# Altium schematic sheet CELLULAR - nRF9160.SchDoc: CELLULAR - nRF9160
size A3; Organization: Tekt Industries; DocumentNumber: 1; Revision: A.01; SheetNumber: 1; SheetTotal: 3; ApprovedBy: M J Adams; CheckedBy: M J Adams; Author: M J Adams; CompanyName: Tekt Industries; DrawnBy: M J Adams; Engineer: M J Adams; DocumentSize: A3; ProjectTitle: CODE OF CONSCIENCE
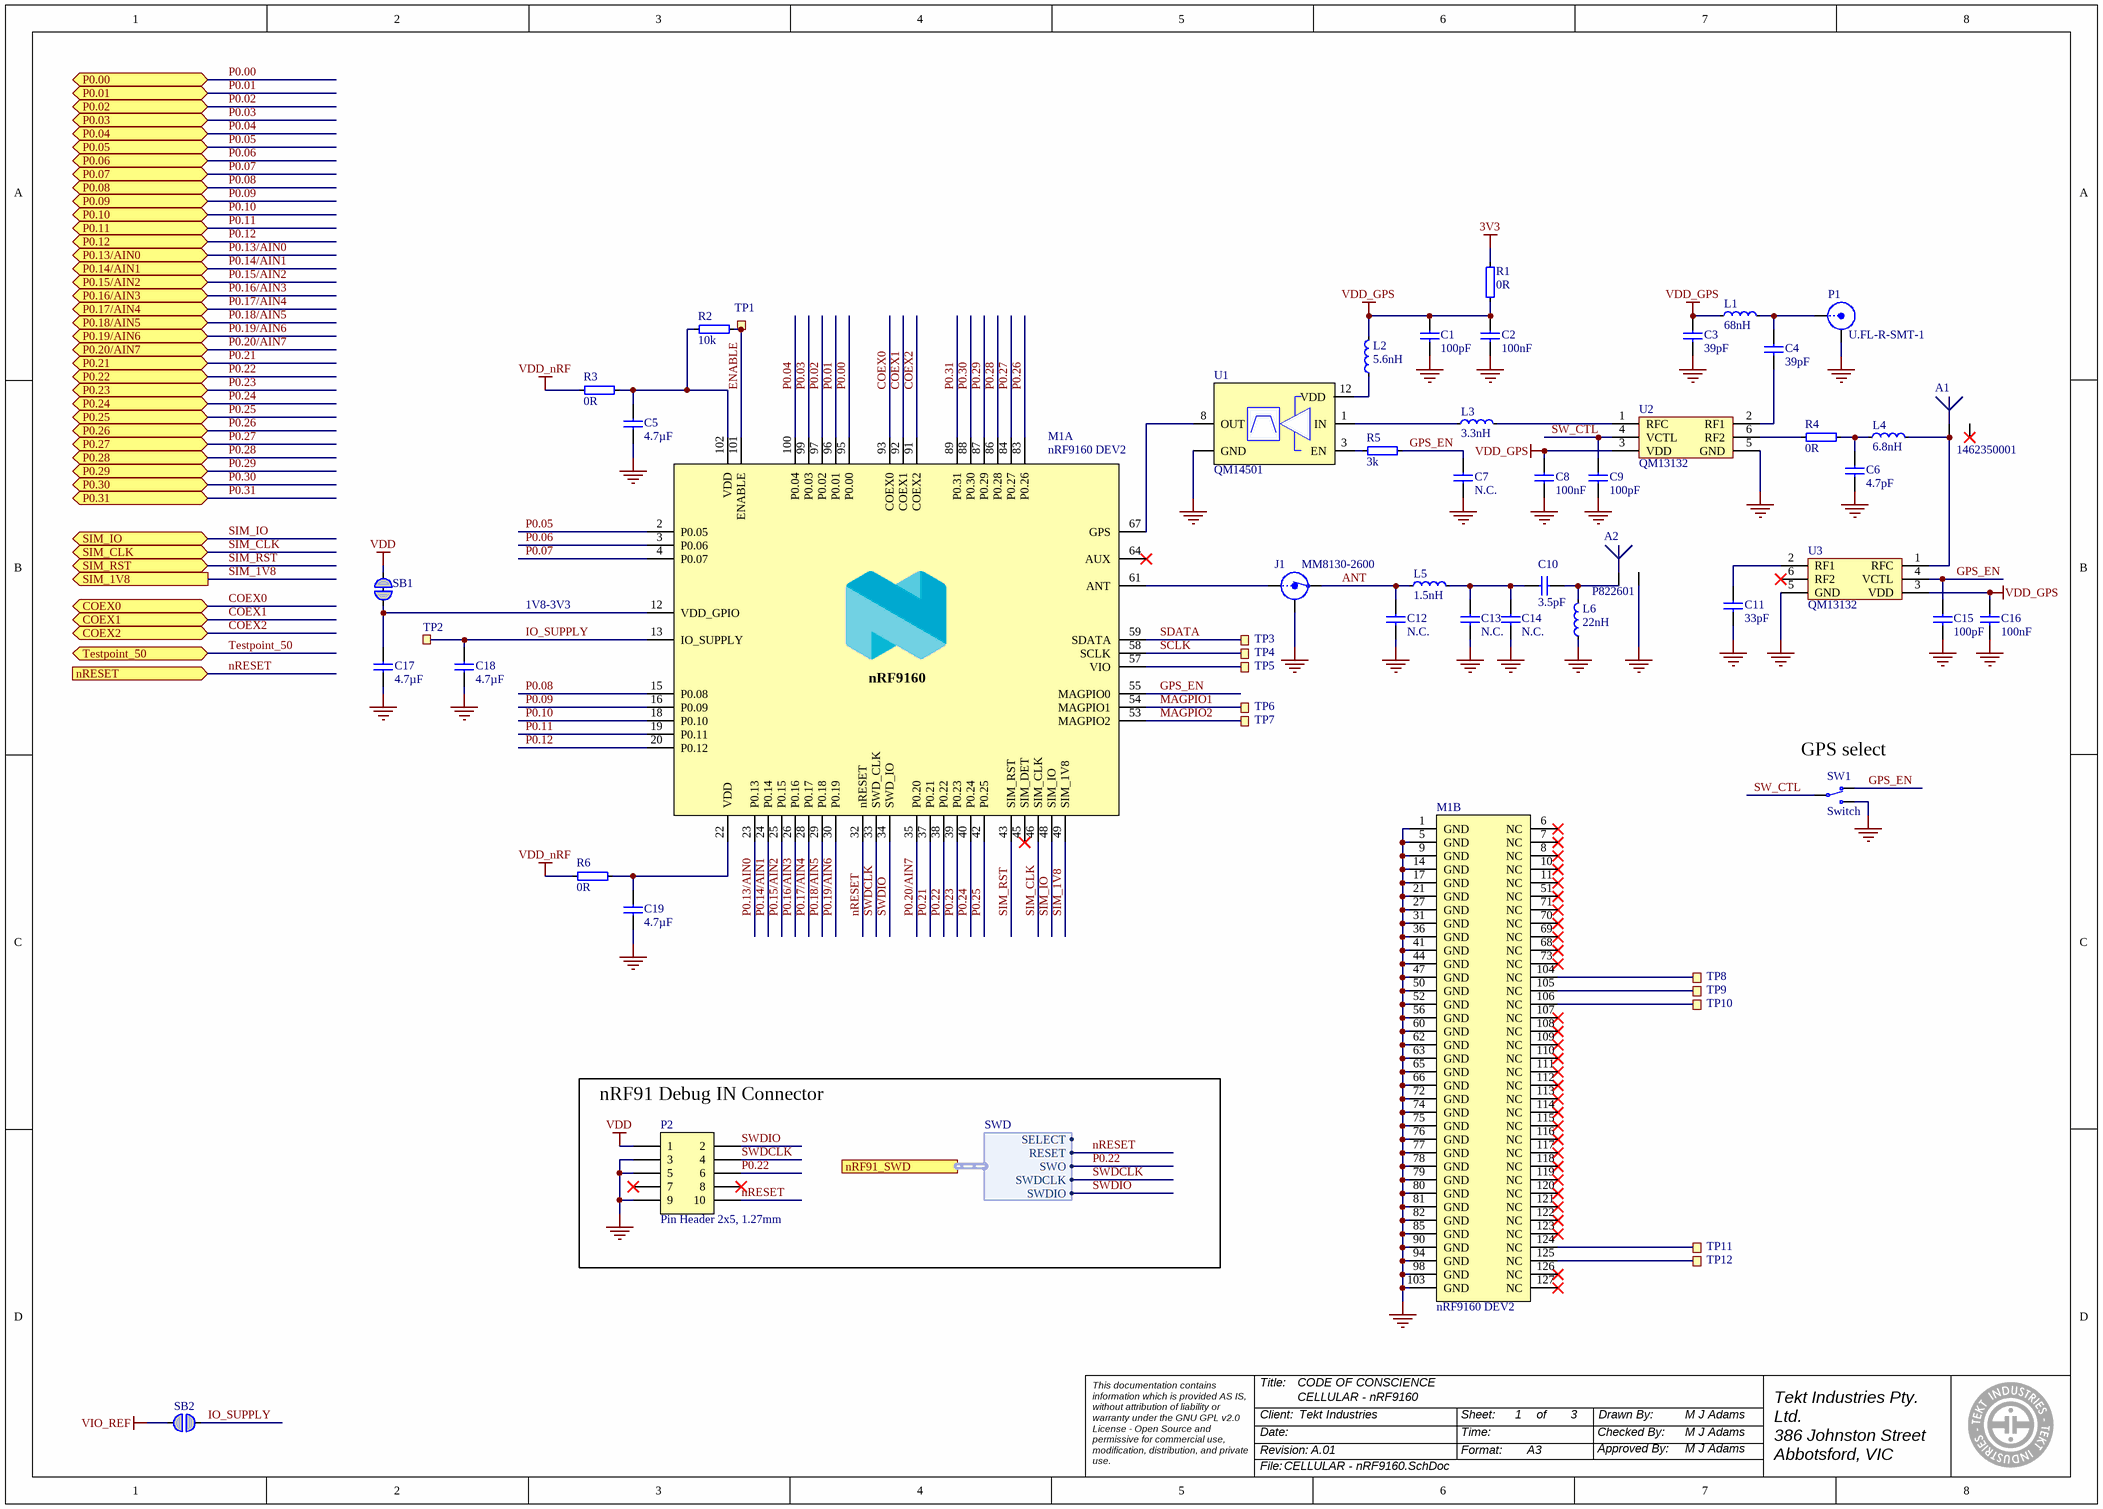
[diagram p0: CELLULAR - nRF9160.SchDoc]

## Parts
A1  1462350001  [1462350001]
A2  P822601  [P822601]
C1  100pF  [CAPC0603X03L_C]
C2  100nF  [CAPC0603X03L_C]
C3  39pF  [CAPC0603X03L_C]
C4  39pF  [CAPC0603X03L_C]
C5  4.7µF  [CAPC1005X04L]
C6  4.7pF  [CAPC0603X03L_C]
C7  N.C.  [CAPC0603X03L_C]
C8  100nF  [CAPC0603X03L_C]
C9  100pF  [CAPC0603X03L_C]
C10  3.5pF  [CAPC0603X03L_C]
C11  33pF  [CAPC0603X03L_C]
C12  N.C.  [CAPC0603X03L_C]
C13  N.C.  [CAPC0603X03L_C]
C14  N.C.  [CAPC0603X03L_C]
C15  100pF  [CAPC0603X03L_C]
C16  100nF  [CAPC0603X03L_C]
C17  4.7µF  [CAPC1005X04L]
C18  4.7µF  [CAPC1005X04L]
C19  4.7µF  [CAPC1005X04L]
J1  MM8130-2600  [COAXIAL-SWF]
L1  68nH  [INDC1005X04L]
L2  5.6nH  [INDC0603X03L_C]
L3  3.3nH  [INDC0603X03L_C]
L4  6.8nH  [INDC0603X03L_C]
L5  1.5nH  [INDC0603X03L_C]
L6  22nH  [INDC0603X03L_C]
M1  nRF9160 DEV2  [nRF9160_DEV2_MODULE]  (parts A,B of 2)
P1  U.FL-R-SMT-1  [COAXIAL RF U.FL-R-SMT-1]
P2  Pin Header 2x5, 1.27mm  [HDR_2x5-SMD-1.27mm-K]
R1  0R  [RESC1005X04L]
R2  10k  [RESC0603X03L_C]
R3  0R  [RESC0603X03L_C]
R4  0R  [RESC0603X03L_C]
R5  3k  [RESC0603X03L_C]
R6  0R  [RESC0603X03L_C]
SB1  Solderbridge  [Solderbridge_Shorted]  (value not drawn)  (net tie, no BOM)
SB2  Solderbridge  [Solderbridge]  (value not drawn)  (no BOM)
SW1  Switch  [CJS-120xA]
TP1  Ø1.5mm,SMD  [TP_SMD_Ø1.5mm]  (value not drawn)  (no BOM)
TP2  Ø1.0mm,SMD  [TP_SMD_Ø1.0mm]  (value not drawn)  (no BOM)
TP3  Ø1.0mm,SMD  [TP_SMD_Ø1.0mm]  (value not drawn)  (no BOM)
TP4  Ø1.0mm,SMD  [TP_SMD_Ø1.0mm]  (value not drawn)  (no BOM)
TP5  Ø1.0mm,SMD  [TP_SMD_Ø1.0mm]  (value not drawn)  (no BOM)
TP6  Ø1.0mm,SMD  [TP_SMD_Ø1.0mm]  (value not drawn)  (no BOM)
TP7  Ø1.0mm,SMD  [TP_SMD_Ø1.0mm]  (value not drawn)  (no BOM)
TP8  Ø1.0mm,SMD  [TP_SMD_Ø1.0mm]  (value not drawn)  (no BOM)
TP9  Ø1.0mm,SMD  [TP_SMD_Ø1.0mm]  (value not drawn)  (no BOM)
TP10  Ø1.0mm,SMD  [TP_SMD_Ø1.0mm]  (value not drawn)  (no BOM)
TP11  Ø1.0mm,SMD  [TP_SMD_Ø1.0mm]  (value not drawn)  (no BOM)
TP12  Ø1.0mm,SMD  [TP_SMD_Ø1.0mm]  (value not drawn)  (no BOM)
U1  QM14501  [QM14501]
U2  QM13132  [QM13132]
U3  QM13132  [QM13132]

## Blocks framed on the sheet
nRF91 Debug IN Connector: P2

## Ports
COEX0 (bidir), COEX1 (bidir), COEX2 (bidir), nRESET (in), nRF91_SWD (harness SWD), P0.00 (bidir), P0.01 (bidir), P0.02 (bidir), P0.03 (bidir), P0.04 (bidir), P0.05 (bidir), P0.06 (bidir), P0.07 (bidir), P0.08 (bidir), P0.09 (bidir), P0.10 (bidir), P0.11 (bidir), P0.12 (bidir), P0.13/AIN0 (bidir), P0.14/AIN1 (bidir), P0.15/AIN2 (bidir), P0.16/AIN3 (bidir), P0.17/AIN4 (bidir), P0.18/AIN5 (bidir), P0.19/AIN6 (bidir), P0.20/AIN7 (bidir), P0.21 (bidir), P0.22 (bidir), P0.23 (bidir), P0.24 (bidir), P0.25 (bidir), P0.26 (bidir), P0.27 (bidir), P0.28 (bidir), P0.29 (bidir), P0.30 (bidir), P0.31 (bidir), SIM_1V8 (out), SIM_CLK (bidir), SIM_IO (bidir), SIM_RST (bidir), Testpoint_50 (bidir)

## Harnesses
SWD: SWDIO, SWDCLK, SWO, RESET, SELECT

## Nets
3V3: R1.1
GND: A2.2 C1.1 C2.1 C3.2 C5.2 C6.2 C7.1 C8.2 C9.2 C11.2 C12.1 C13.1 C14.1 C15.2 C16.2 C17.2 C18.2 C19.1 J1.2(Shield) L6.1 M1.1(GND) M1.5(GND) M1.9(GND) M1.14(GND) M1.17(GND) M1.21(GND) M1.27(GND) M1.31(GND) M1.36(GND) M1.41(GND) M1.44(GND) M1.47(GND) M1.50(GND) M1.52(GND) M1.56(GND) M1.60(GND) M1.62(GND) M1.63(GND) M1.65(GND) M1.66(GND) M1.72(GND) M1.74(GND) M1.75(GND) M1.76(GND) M1.77(GND) M1.78(GND) M1.79(GND) M1.80(GND) M1.81(GND) M1.82(GND) M1.85(GND) M1.90(GND) M1.94(GND) M1.98(GND) M1.103(GND) P1.2(Y) P2.3 P2.5 P2.9 SW1.3(N.O) U1.2(GND) U1.4(GND) U1.5(GND) U1.6(GND) U1.7(GND) U1.9(GND) U1.10(GND) U1.11(GND) U2.5(GND) U3.5(GND)
VDD: P2.1 SB1.1
VDD_GPS: C1.2 C2.2 C3.1 C8.1 C16.1 L1.1 L2.2 R1.2 U2.3(VDD) U3.3(VDD)
VDD_nRF: R3.1 R6.1
VIO_REF: SB2.2
ANT: C12.2 J1.3(OUT) L5.1
COEX0: M1.93(COEX0) ; port COEX0
COEX1: M1.92(COEX1) ; port COEX1
COEX2: M1.91(COEX2) ; port COEX2
ENABLE: M1.101(ENABLE) R2.2 TP1.1
GPS_EN: C7.2 C15.1 M1.55(MAGPIO0) R5.2 SW1.1(N.C) U3.4(VCTL)
IO_SUPPLY: C18.1 M1.13(IO_SUPPLY) SB2.1 TP2.1
MAGPIO1: M1.54(MAGPIO1) TP6.1
MAGPIO2: M1.53(MAGPIO2) TP7.1
nRESET: M1.32(nRESET) P2.10 ; port nRESET, port nRF91_SWD.RESET
P0.00: M1.95(P0.00) ; port P0.00
P0.01: M1.96(P0.01) ; port P0.01
P0.02: M1.97(P0.02) ; port P0.02
P0.03: M1.99(P0.03) ; port P0.03
P0.04: M1.100(P0.04) ; port P0.04
P0.05: M1.2(P0.05) ; port P0.05
P0.06: M1.3(P0.06) ; port P0.06
P0.07: M1.4(P0.07) ; port P0.07
P0.08: M1.15(P0.08) ; port P0.08
P0.09: M1.16(P0.09) ; port P0.09
P0.10: M1.18(P0.10) ; port P0.10
P0.11: M1.19(P0.11) ; port P0.11
P0.12: M1.20(P0.12) ; port P0.12
P0.13/AIN0: M1.23(P0.13) ; port P0.13/AIN0
P0.14/AIN1: M1.24(P0.14) ; port P0.14/AIN1
P0.15/AIN2: M1.25(P0.15) ; port P0.15/AIN2
P0.16/AIN3: M1.26(P0.16) ; port P0.16/AIN3
P0.17/AIN4: M1.28(P0.17) ; port P0.17/AIN4
P0.18/AIN5: M1.29(P0.18) ; port P0.18/AIN5
P0.19/AIN6: M1.30(P0.19) ; port P0.19/AIN6
P0.20/AIN7: M1.35(P0.20) ; port P0.20/AIN7
P0.21: M1.37(P0.21) ; port P0.21
P0.22: M1.38(P0.22) P2.6 ; port P0.22, port nRF91_SWD.SWO
P0.23: M1.39(P0.23) ; port P0.23
P0.24: M1.40(P0.24) ; port P0.24
P0.25: M1.42(P0.25) ; port P0.25
P0.26: M1.83(P0.26) ; port P0.26
P0.27: M1.84(P0.27) ; port P0.27
P0.28: M1.86(P0.28) ; port P0.28
P0.29: M1.87(P0.29) ; port P0.29
P0.30: M1.88(P0.30) ; port P0.30
P0.31: M1.89(P0.31) ; port P0.31
SCLK: M1.58(SCLK) TP4.1
SDATA: M1.59(SDATA) TP3.1
SIM_1V8: M1.49(SIM_1V8) ; port SIM_1V8
SIM_CLK: M1.46(SIM_CLK) ; port SIM_CLK
SIM_IO: M1.48(SIM_IO) ; port SIM_IO
SIM_RST: M1.43(SIM_RST) ; port SIM_RST
SW_CTL: C9.1 SW1.2(COM) U2.4(VCTL)
SWDCLK: M1.33(SWD_CLK) P2.4 ; port nRF91_SWD.SWDCLK
SWDIO: M1.34(SWD_IO) P2.2 ; port nRF91_SWD.SWDIO
Testpoint_50: port Testpoint_50
NetA1_1: A1.1 L4.2 U3.1(RFC)
NetA2_1: A2.1 C10.2 L6.2
NetC4_1: C4.1 U2.2(RF1)
NetC4_2: C4.2 L1.2 P1.1(X)
NetC5_1: C5.1 M1.102(VDD) R2.1 R3.2
NetC6_1: C6.1 L4.1 R4.2
NetC10_1: C10.1 C13.2 C14.2 L5.2
NetC11_1: C11.1 U3.2(RF1)
NetC17_1: C17.1 M1.12(VDD_GPIO) SB1.2
NetC19_2: C19.2 M1.22(VDD) R6.2
NetJ1_1: J1.1(IN) M1.61(ANT)
NetL2_1: L2.1 U1.12(VDD)
NetL3_1: L3.1 U1.1(IN)
NetL3_2: L3.2 U2.1(RFC)
NetM1_57: M1.57(VIO) TP5.1
NetM1_67: M1.67(GPS) U1.8(OUT)
NetM1_104: M1.104(NC) TP8.1
NetM1_105: M1.105(NC) TP9.1
NetM1_106: M1.106(NC) TP10.1
NetM1_124: M1.124(NC) TP11.1
NetM1_125: M1.125(NC) TP12.1
NetR4_1: R4.1 U2.6(RF2)
NetR5_1: R5.1 U1.3(EN)

Not connected (* = marked no-connect by the designer): A1 2*; M1 6(NC)* 7(NC)* 8(NC)* 10(NC)* 11(NC)* 45(SIM_DET)* 51(NC)* 64(AUX)* 68(NC)* 69(NC)* 70(NC)* 71(NC)* 73(NC)* 107(NC)* 108(NC)* 109(NC)* 110(NC)* 111(NC)* 112(NC)* 113(NC)* 114(NC)* 115(NC)* 116(NC)* 117(NC)* 118(NC)* 119(NC)* 120(NC)* 121(NC)* 122(NC)* 123(NC)* 126(NC)* 127(NC)*; P2 7* 8*; U3 6(RF2)*

## Notes on the sheet
- 1V8-3V3
- (near SW1) GPS select
- Title:
- Date:
- Revision:
- Client:
- Sheet:
- Time:
- Format:
- A3
- of
- Checked By:
- Approved By:
- Drawn By:
- Tekt Industries Pty. Ltd.
  386 Johnston Street
  Abbotsford, VIC
  Australia, 3067
- This documentation contains information which is provided AS IS, without attribution of liability or warranty under the GNU GPL v2.0 License - Open Source and permissive for commercial use, modification, distribution, and private use.
- File:
- (in symbol nRF9160_DEV2_MODULE_DK, part A) nRF9160

## Library data of the parts
A1 = 1462350001_GPS: ANTENNA MOLDED 1.575GHZ GPS; Manufacturer: Molex; Assembly: Mounted; Artikkelnr Noca: N.A.; Part Number: 1462350001_GPS; Manufacturer Part No.: 1462350001; ComponentLink1URL: *; ComponentLink1Description: Datasheet; ComponentLink2URL: *; ComponentLink2Description: Supplier link; HelpURL: https://www.molex.com/pdm_docs/sd/1462350001_sd.pdf; Footprint Doc: 1462350001; LatestRevisionDate: 2018-04-30; Pin Count: 3; Publisher: Nordic Semiconductor; Published: 2018-04-30; Value: 1462350001; Note: *; Supplier: Digi-Key; Supplier Part No.: WM15009CT-ND; Supplier 2: 538-146235-0001; Supplier Part Number 2: *; Part number IPS: N.A.
A2 = P822601: ANTENNA PRESTTA OCTABAND LTE; Manufacturer: Ethertronics; Artikkelnr Noca: N.A.; Part Number: P822601; Manufacturer Part No.: P822601; Footprint Doc: P822601; LatestRevisionDate: 2017-07-28; Pin Count: 2; Publisher: Nordic Semiconductor; Published: 2017-07-28; Value: P822601; Note: *; ComponentLink1URL: *; ComponentLink1Description: Datasheet; ComponentLink2URL: *; ComponentLink2Description: Supplier link; HelpURL: http://www.ethertronics.com/wp-content/uploads/2016/11/Prestta-P822601-P822602-Standard-Cellular-Octa-Band-20160904.pdf; Supplier: Digi-Key; Supplier Part No.: 939-1057-1-ND; Supplier 2: Digikey; Supplier Part Number 2: 939-1057-1-ND; Part number IPS: N.A.
C1 C9 C15 = C0201-100p: Capacitor, NP0, ±2%; Manufacturer: Murata Electronics North America; Manufacturer Part No.: GRM0335C1E101JA01D; Part number IPS: 00000007853; Note: 25V; Artikkelnr Noca: N.A.; Part Number: C0201-100p; ComponentLink1URL: *; ComponentLink1Description: Datasheet; ComponentLink2URL: *; ComponentLink2Description: Supplier link; HelpURL: *; Footprint Doc: 0201; LatestRevisionDate: 2017-11-09; Pin Count: 2; Publisher: Nordic Semiconductor; Published: 2014-11-13; Value: 100pF; Supplier: Digi-Key; Supplier Part No.: 490-3160-1-ND; Supplier 2: *; Supplier Part Number 2: *
C2 C8 C16 = C0201-100n: Capacitor, X5R, ±10%; Manufacturer: Murata Electronics North America; Manufacturer Part No.: GRM033R61C104KE84D; Part number IPS: 00000001248; Note: 16V; Artikkelnr Noca: N.A.; Part Number: C0201-100n; ComponentLink1URL: *; ComponentLink1Description: Datasheet; ComponentLink2URL: *; ComponentLink2Description: Supplier link; HelpURL: *; Footprint Doc: 0201; LatestRevisionDate: 2017-11-09; Pin Count: 2; Publisher: Nordic Semiconductor; Published: 2014-11-13; Value: 100nF; Supplier: Digi-Key; Supplier Part No.: 490-9985-1-ND; Supplier 2: *; Supplier Part Number 2: *
C3 C4 = C0201-39p: Chip Cap 0201; Manufacturer: Murata Electronics North America; Manufacturer Part No.: GRM0335C1H390JA01D; Note: Chip Cap 1%; Artikkelnr Noca: N.A.; Part Number: C0201-39p; ComponentLink1URL: *; ComponentLink1Description: Datasheet; ComponentLink2URL: *; ComponentLink2Description: Supplier link; HelpURL: *; Footprint Doc: 0201; LatestRevisionDate: 2014-11-13; Pin Count: 2; Publisher: Nordic Semiconductor; Published: 2014-11-13; Value: 39pF; Supplier: Digi-Key; Supplier Part No.: 490-11326-1-ND; Supplier 2: *; Supplier Part Number 2: *; Part number IPS: N.A.
C5 C17-C19 = C0402-4µ7: Capacitor, X5R, ±20%; Manufacturer: Murata Electronics North America; Manufacturer Part No.: ZRB15XR61A475KE01D; Part number IPS: 00000001251; Note: 10V; Artikkelnr Noca: 20039482; Part Number: C0402-4µ7; ComponentLink1URL: *; ComponentLink1Description: Datasheet; ComponentLink2URL: *; ComponentLink2Description: Supplier link; HelpURL: *; Footprint Doc: 0402; LatestRevisionDate: 2017-11-09; Pin Count: 2; Publisher: Nordic Semiconductor; Published: 2009-05-08; Value: 4.7µF; Supplier: Digi-Key; Supplier Part No.: 490-13252-1-ND; Supplier 2: *; Supplier Part Number 2: *
C6 = C0201-4.7p: Chip Cap 0201; Manufacturer: Murata Electronics North America; Manufacturer Part No.: GRM0335C1H4R7CA01D; Note: Chip Cap 1%; Artikkelnr Noca: N.A.; Part Number: C0201-4.7p; ComponentLink1URL: *; ComponentLink1Description: Datasheet; ComponentLink2URL: *; ComponentLink2Description: Supplier link; HelpURL: *; Footprint Doc: 0201; LatestRevisionDate: 2014-11-13; Pin Count: 2; Publisher: Nordic Semiconductor; Published: 2014-11-13; Value: 4.7pF; Supplier: Digi-Key; Supplier Part No.: 490-6130-1-ND; Supplier 2: *; Supplier Part Number 2: *; Part number IPS: N.A.
C7 C12-C14 = C0201-N.C.: Not mounted; Note: Chip Cap; Artikkelnr Noca: N.A.; Assembly: Not mounted; Part Number: C0201-N.C.; ComponentLink1URL: *; ComponentLink1Description: Datasheet; ComponentLink2URL: *; ComponentLink2Description: Supplier link; HelpURL: *; Footprint Doc: 0201; LatestRevisionDate: 2014-11-13; Pin Count: 2; Publisher: Nordic Semiconductor; Published: 2014-11-13; Value: N.C.; Part number IPS: N.A.; Supplier Part No.: *; Supplier 2: *
C10 = C0201-3.3p: Chip Cap 0201; Manufacturer: Taiyo Yuden; Manufacturer Part No.: UMK063CG3R5CTHF; Note: Chip Cap 1%; Artikkelnr Noca: N.A.; Part Number: C0201-3.3p; ComponentLink1URL: *; ComponentLink1Description: Datasheet; ComponentLink2URL: *; ComponentLink2Description: Supplier link; HelpURL: *; Footprint Doc: 0201; LatestRevisionDate: 2014-11-13; Pin Count: 2; Publisher: Nordic Semiconductor; Published: 2014-11-13; Value: 3.5pF; Part number IPS: N.A.; Supplier: Digi-Key; Supplier Part No.: 587-5326-1-ND; Supplier 2: *; Supplier Part Number 2: *
C11 = C0201-33p: Chip Cap 0201; Manufacturer: Murata Electronics North America; Manufacturer Part No.: GRM0335C1H330JA01D; Note: Chip Cap 1%; Artikkelnr Noca: N.A.; Part Number: C0201-33p; ComponentLink1URL: *; ComponentLink1Description: Datasheet; ComponentLink2URL: *; ComponentLink2Description: Supplier link; HelpURL: *; Footprint Doc: 0201; LatestRevisionDate: 2014-11-13; Pin Count: 2; Publisher: Nordic Semiconductor; Published: 2014-11-13; Value: 33pF; Supplier: Digi-Key; Supplier Part No.: 490-6126-1-ND; Supplier 2: *; Supplier Part Number 2: *; Part number IPS: N.A.
J1 = MM8130-2600: Coaxial Connector with Switch; Manufacturer: Murata; Part number IPS: N.A.; Artikkelnr Noca: 55029011; Part Number: MM8130-2600; Manufacturer Part No.: MM8130-2600; LatestRevisionDate: 2014-04-24; Pin Count: 3; Publisher: Nordic Semiconductor; Published: 2014-04-24; Value: MM8130-2600; Note: *; Footprint Doc: COAXIAL-SWF; ComponentLink1URL: *; ComponentLink1Description: Datasheet; ComponentLink2URL: *; ComponentLink2Description: Supplier link; HelpURL: http://www.murata.com/products/catalog/pdf/o33e.pdf; Supplier: Digi-Key; Supplier Part No.: 490-4981-1-ND; Supplier 2: Mouser; Supplier Part Number 2: 81-MM8130-2600RA2
L1 = L0402-68n: Chip Inductor; Manufacturer: Murata Electronics North America; Manufacturer Part No.: LQG15HS68NJ02D; Artikkelnr Noca: N.A.; Part Number: L0402-68n; ComponentLink1URL: *; ComponentLink1Description: Datasheet; ComponentLink2URL: *; ComponentLink2Description: Supplier link; HelpURL: *; Footprint Doc: 0402; LatestRevisionDate: 2014-06-12; Pin Count: 2; Publisher: Nordic Semiconductor; Published: 2014-06-12; Value: 68nH; Note: *; Supplier: Digi-Key; Supplier Part No.: 490-2633-1-ND; Supplier 2: *; Supplier Part Number 2: *; Part number IPS: N.A.
L2 = L0201-5n6: Chip Inductor; Manufacturer: Murata Electronics North America; Manufacturer Part No.: LQP03TN5N6H02D; Note: High frequency chip inductor ±5%; Artikkelnr Noca: N.A.; Part Number: L0201-5n6; ComponentLink1URL: *; ComponentLink1Description: Datasheet; ComponentLink2Description: Supplier link; HelpURL: *; Footprint Doc: 0201; LatestRevisionDate: 2013-04-10; Pin Count: 2; Publisher: Nordic Semiconductor; Published: 2013-04-10; Value: 5.6nH; Part number IPS: N.A.; ComponentLink2URL: *; Supplier: Digi-Key; Supplier Part No.: 490-6734-1-ND; Supplier 2: *; Supplier Part Number 2: *
L3 = L0201-3n3: Chip Inductor; Manufacturer: Murata Electronics North America; Manufacturer Part No.: LQP03TN3N3B02D; Note: High frequency chip inductor ±5%; Artikkelnr Noca: N.A.; Part Number: L0201-3n3; ComponentLink1URL: *; ComponentLink1Description: Datasheet; ComponentLink2Description: Supplier link; HelpURL: *; Footprint Doc: 0201; LatestRevisionDate: 2013-04-10; Pin Count: 2; Publisher: Nordic Semiconductor; Published: 2013-04-10; Value: 3.3nH; Part number IPS: N.A.; ComponentLink2URL: *; Supplier: Digi-Key; Supplier Part No.: 490-6728-1-ND; Supplier 2: *; Supplier Part Number 2: *
L4 = L0201-6n8: Chip Inductor; Manufacturer: Murata Electronics North America; Manufacturer Part No.: LQP03TN6N8J02D; Note: High frequency chip inductor ±5%; Artikkelnr Noca: N.A.; Part Number: L0201-6n8; ComponentLink1URL: *; ComponentLink1Description: Datasheet; ComponentLink2URL: *; ComponentLink2Description: Supplier link; HelpURL: *; Footprint Doc: 0201; LatestRevisionDate: 2013-04-10; Pin Count: 2; Publisher: Nordic Semiconductor; Published: 2013-04-10; Value: 6.8nH; Supplier: Digi-Key; Supplier Part No.: 490-5564-1-ND; Supplier 2: *; Supplier Part Number 2: *; Part number IPS: N.A.
L5 = L0201-1n5: Chip Inductor; Manufacturer: Murata Electronics North America; Manufacturer Part No.: LQP03TG1N5B02D; Note: High frequency chip inductor ±5%; Artikkelnr Noca: N.A.; Part Number: L0201-1n5; ComponentLink1URL: *; ComponentLink1Description: Datasheet; ComponentLink2Description: Supplier link; HelpURL: *; Footprint Doc: 0201; LatestRevisionDate: 2013-04-10; Pin Count: 2; Publisher: Nordic Semiconductor; Published: 2013-04-10; Value: 1.5nH; Part number IPS: N.A.; ComponentLink2URL: *; Supplier: Digi-Key; Supplier Part No.: 490-14701-1-ND; Supplier 2: *; Supplier Part Number 2: *
L6 = L0201-22n: Chip Inductor; Manufacturer: Taiyo Yuden; Manufacturer Part No.: HKQ0603W22NH-T; Note: High frequency chip inductor ±10%; Artikkelnr Noca: N.A.; Part Number: L0201-22n; ComponentLink1URL: *; ComponentLink1Description: Datasheet; ComponentLink2Description: Supplier link; HelpURL: *; Footprint Doc: 0201; LatestRevisionDate: 2013-04-10; Pin Count: 2; Publisher: Nordic Semiconductor; Published: 2013-04-10; Value: 22nH; Part number IPS: N.A.; ComponentLink2URL: *; Supplier: Digi-Key; Supplier Part No.: 587-4663-1-ND; Supplier 2: *; Supplier Part Number 2: *
M1 = nRF9160_DEV2_MODULE_DK: nRF9160 MODULE, SiP LGA; Manufacturer: Nordic Semiconductor ASA; Manufacturer Part No.: NRF9160-SICA; Part number Sanmina: LFNPNSM800002; Delivery: X; Part Number: nRF9160_DEV2_MODULE_DK; Datasheet: *; Footprint Doc: 16.0*10.5*1.1; Pin Count: 161; Value: nRF9160 DEV2; Supplier: Digi-Key; 2nd Manufacturer: *; 2nd Manufacturer Part Number: *; 3rd Manufacturer: *; 3rd Manufacturer Part Number: *; Supplier Part No.: 1490-1074-1-ND
P1 = U.FL-R-SMT-1: ONN U.FL RCPT STR 50 OHM SMD; Manufacturer: Hirose Electric Co Ltd; Artikkelnr Noca: N.A.; Part Number: U.FL-R-SMT-1; Manufacturer Part No.: U.FL-R-SMT-1; ComponentLink1URL: https://media.digikey.com/pdf/Data%20Sheets/Hirose%20PDFs/UFL%20Series.pdf; ComponentLink1Description: Datasheet; ComponentLink2URL: *; ComponentLink2Description: Supplier link; HelpURL: *; Footprint Doc: COAXIAL RF U.FL-R-SMT-1; LatestRevisionDate: 2018-05-07; Pin Count: 3; Publisher: Nordic Semiconductor; Published: 2018-05-07; Value: U.FL-R-SMT-1; Note: *; Supplier: Digi-Key; Supplier Part No.: H11891DKR-ND; Supplier 2: *; Supplier Part Number 2: *; Part number IPS: N.A.
P2 = Pin Header 2x5 SMD, 1.27mm, KS: Pin Header 2x5, 1.27mm (50mil), SMD, Keying Shroud; Manufacturer: Samtec Inc.; Manufacturer Part No.: FTSH-105-01-F-DV-K-TR; Part number IPS: N.A.; Artikkelnr Noca: 55010009; Part Number: Pin Header 2x5 SMD, 1.27mm, KS; Footprint Doc: HDR_2x5-SMD-1.27mm; LatestRevisionDate: 2016-04-21; Pin Count: 10; Publisher: Nordic Semiconductor; Published: 2016-01-22; Value: Pin Header 2x5, 1.27mm; Note: *; ComponentLink1URL: *; ComponentLink1Description: Datasheet; ComponentLink2URL: *; ComponentLink2Description: Supplier link; HelpURL: \\hizz\pro\app9717\Datasheet\connectores\W-CON\3132-XXMXXBK00XX.pdf; Supplier: Digi-Key; Supplier Part No.: SAM13160CT-ND; Supplier 2: Samtec; Supplier Part Number 2: FTSH-105-01-F-DV-K
R1 = R0402-0R: Resistor, ±5%, 0.063W; Manufacturer: Stackpole Electronics Inc; Part number IPS: N.A.; Manufacturer Part No.: RMCF0402ZT0R00; Note: Chip Res 5%; Artikkelnr Noca: 27049000; Part Number: R0402-0R; ComponentLink1URL: *; ComponentLink1Description: Datasheet; ComponentLink2URL: *; ComponentLink2Description: Supplier link; HelpURL: *; Footprint Doc: 0402; LatestRevisionDate: 2009-11-23; Pin Count: 2; Publisher: Nordic Semiconductor; Published: 2009-05-08; Value: 0R; Supplier: Digi-Key; Supplier Part No.: RMCF0402ZT0R00CT-ND; Supplier 2: *; Supplier Part Number 2: *
R2 = R0201-10k: Resistor, ±1%, 0.05W; Manufacturer: Samsung Electro-Mechanics; Manufacturer Part No.: RC0603F103CS; Part number IPS: 00000001255; Note: Chip Res 1%; Artikkelnr Noca: N.A.; Part Number: R0201-10k; ComponentLink1URL: *; ComponentLink1Description: Datasheet; ComponentLink2URL: *; ComponentLink2Description: Supplier link; HelpURL: *; Footprint Doc: 0201; LatestRevisionDate: 2014-11-13; Pin Count: 2; Publisher: Nordic Semiconductor; Published: 2014-11-13; Value: 10k; Supplier: Digi-Key; Supplier Part No.: 1276-3670-1-ND; Supplier 2: *; Supplier Part Number 2: *
R3 R4 R6 = R0201-0R: Resistor, ±5%, 0.05W; Manufacturer: Yageo; Manufacturer Part No.: RC0201JR-070RL; Part number IPS: 00000003245; Note: Chip Res 5%; Artikkelnr Noca: N.A.; Part Number: R0201-0R; ComponentLink1URL: *; ComponentLink1Description: Datasheet; ComponentLink2URL: *; ComponentLink2Description: Supplier link; HelpURL: *; Footprint Doc: 0201; LatestRevisionDate: 2017-11-09; Pin Count: 2; Publisher: Nordic Semiconductor; Published: 2014-11-13; Value: 0R; Supplier: Digi-Key; Supplier Part No.: 311-0.0NCT-ND; Supplier 2: *; Supplier Part Number 2: *
R5 = R0201-3k: Resistor, ±1%, 0.05W; Manufacturer: Yageo; Manufacturer Part No.: RC0201FR-073KL; Note: Chip Res 1%; Artikkelnr Noca: N.A.; Part Number: R0201-3k; ComponentLink1URL: *; ComponentLink1Description: Datasheet; ComponentLink2URL: *; ComponentLink2Description: Supplier link; HelpURL: *; Footprint Doc: 0201; LatestRevisionDate: 2014-11-13; Pin Count: 2; Publisher: Nordic Semiconductor; Published: 2014-11-13; Value: 3k; Supplier: Digi-Key; Supplier Part No.: YAG2656CT-ND; Supplier 2: *; Supplier Part Number 2: *; Part number IPS: N.A.
SB1 = Solderbridge Shorted: Shorted Solderbridge; Artikkelnr Noca: N.A.; Part Number: Solderbridge Shorted; LatestRevisionDate: 2012-08-07; Pin Count: 2; Publisher: Nordic Semiconductor; Published: 2012-08-07; Value: Solderbridge; Note: *; Footprint Doc: Solderbridge_Shorted; Part number IPS: N.A.; ComponentLink1URL: *; ComponentLink1Description: Datasheet; ComponentLink2URL: *; ComponentLink2Description: Supplier link; HelpURL: *; Supplier Part No.: *; Supplier 2: *
SB2 = Solderbridge: Artikkelnr Noca: N.A.; Part Number: Solderbridge; ComponentLink1URL: *; ComponentLink1Description: Datasheet; ComponentLink2URL: *; ComponentLink2Description: Supplier link; HelpURL: *; Footprint Doc: Solderbridge; LatestRevisionDate: 2009-12-14; Pin Count: 2; Publisher: Nordic Semiconductor; Published: 2009-12-14; Value: Solderbridge; Note: *; Supplier Part No.: *; Supplier 2: *; Part number IPS: N.A.
SW1 = CJS-1200TA: SMD slide Switch (ON-ON); Manufacturer: Copal Electronics Inc; Part number IPS: N.A.; Artikkelnr Noca: 50019068; Part Number: CJS-1200TA; Manufacturer Part No.: CJS-1200TA; ComponentLink1URL: *; ComponentLink1Description: Datasheet; ComponentLink2URL: *; ComponentLink2Description: Supplier link; HelpURL: http://media.digikey.com/pdf/Data%20Sheets/COPAL%20Electronics%20PDFs/CJS.pdf; Footprint Doc: CJS-120xA; LatestRevisionDate: 2012-10-03; Pin Count: 3; Publisher: Nordic Semiconductor; Published: 2012-10-03; Value: Switch; Note: *; Supplier: Digi-Key; Supplier Part No.: 563-1021-2-ND; Supplier 2: *; Supplier Part Number 2: *
TP1 = TP_SMD_Ø1.5MM: 1.0mm circular SMD testpad; Artikkelnr Noca: N.A.; Part Number: TP_SMD_Ø1.5MM; ComponentLink1URL: *; ComponentLink1Description: Datasheet; ComponentLink2URL: *; ComponentLink2Description: Supplier link; HelpURL: *; Footprint Doc: TP_SMD_Ø1.5mm; LatestRevisionDate: 2016-06-02; Pin Count: 1; Publisher: Nordic Semiconductor; Published: 2016-06-02; Value: Ø1.5mm,SMD; Note: *; Part number IPS: N.A.; Supplier Part No.: *; Supplier 2: *
TP2-TP12 = TP_SMD_Ø1.0MM: 1.0mm circular SMD testpad; Artikkelnr Noca: N.A.; Part Number: TP_SMD_Ø1.0MM; ComponentLink1URL: *; ComponentLink1Description: Datasheet; ComponentLink2URL: *; ComponentLink2Description: Supplier link; HelpURL: *; Footprint Doc: TP_SMD_Ø1.0mm; LatestRevisionDate: 2013-06-11; Pin Count: 1; Publisher: Nordic Semiconductor; Published: 2013-06-11; Value: Ø1.0mm,SMD; Note: *; Part number IPS: N.A.; Supplier Part No.: *; Supplier 2: *
U1 = QM14501: GPS, GLONASS, and BeiDou Low Noise Amplifier With Integrated Output SAW Filter, 1.55 to 1.61 GHz, 13.5 dB; Manufacturer: Qorvo; Artikkelnr Noca: N.A.; Part Number: QM14501; Manufacturer Part No.: QM14501; Footprint Doc: QM14501; Pin Count: 12; Value: QM14501; ComponentLink1URL: \\hizz\pro\app9717\Datasheet\integated circuits\qorvo\QM14501 Datasheet.pdf; ComponentLink1Description: Datasheet; ComponentLink2URL: *; ComponentLink2Description: Supplier link; HelpURL: https://www.rfmw.com/Products/Detail/QM14501-Qorvo/597159/; LatestRevisionDate: 2018-10-22; Publisher: Nordic Semiconductor; Published: 2018-01-16; Note: *; Supplier: Qorvo; Supplier Part No.: QM14501; Supplier 2: *; Supplier Part Number 2: *; Part number IPS: N.A.
U2 U3 = QM13132: Single Pole Double Throw Switch; Manufacturer: Qorvo; Artikkelnr Noca: N.A.; Part Number: QM13132; Manufacturer Part No.: QM13132; ComponentLink1URL: *; ComponentLink1Description: Datasheet; ComponentLink2URL: *; ComponentLink2Description: Supplier link; HelpURL: *; Footprint Doc: *; LatestRevisionDate: 2018-12-14; Pin Count: 6; Publisher: Nordic Semiconductor; Published: 2018-12-14; Value: QM13132; Note: *; Supplier: Qorvo; Supplier Part No.: QM13132; Supplier 2: *; Supplier Part Number 2: *; Part number IPS: N.A.